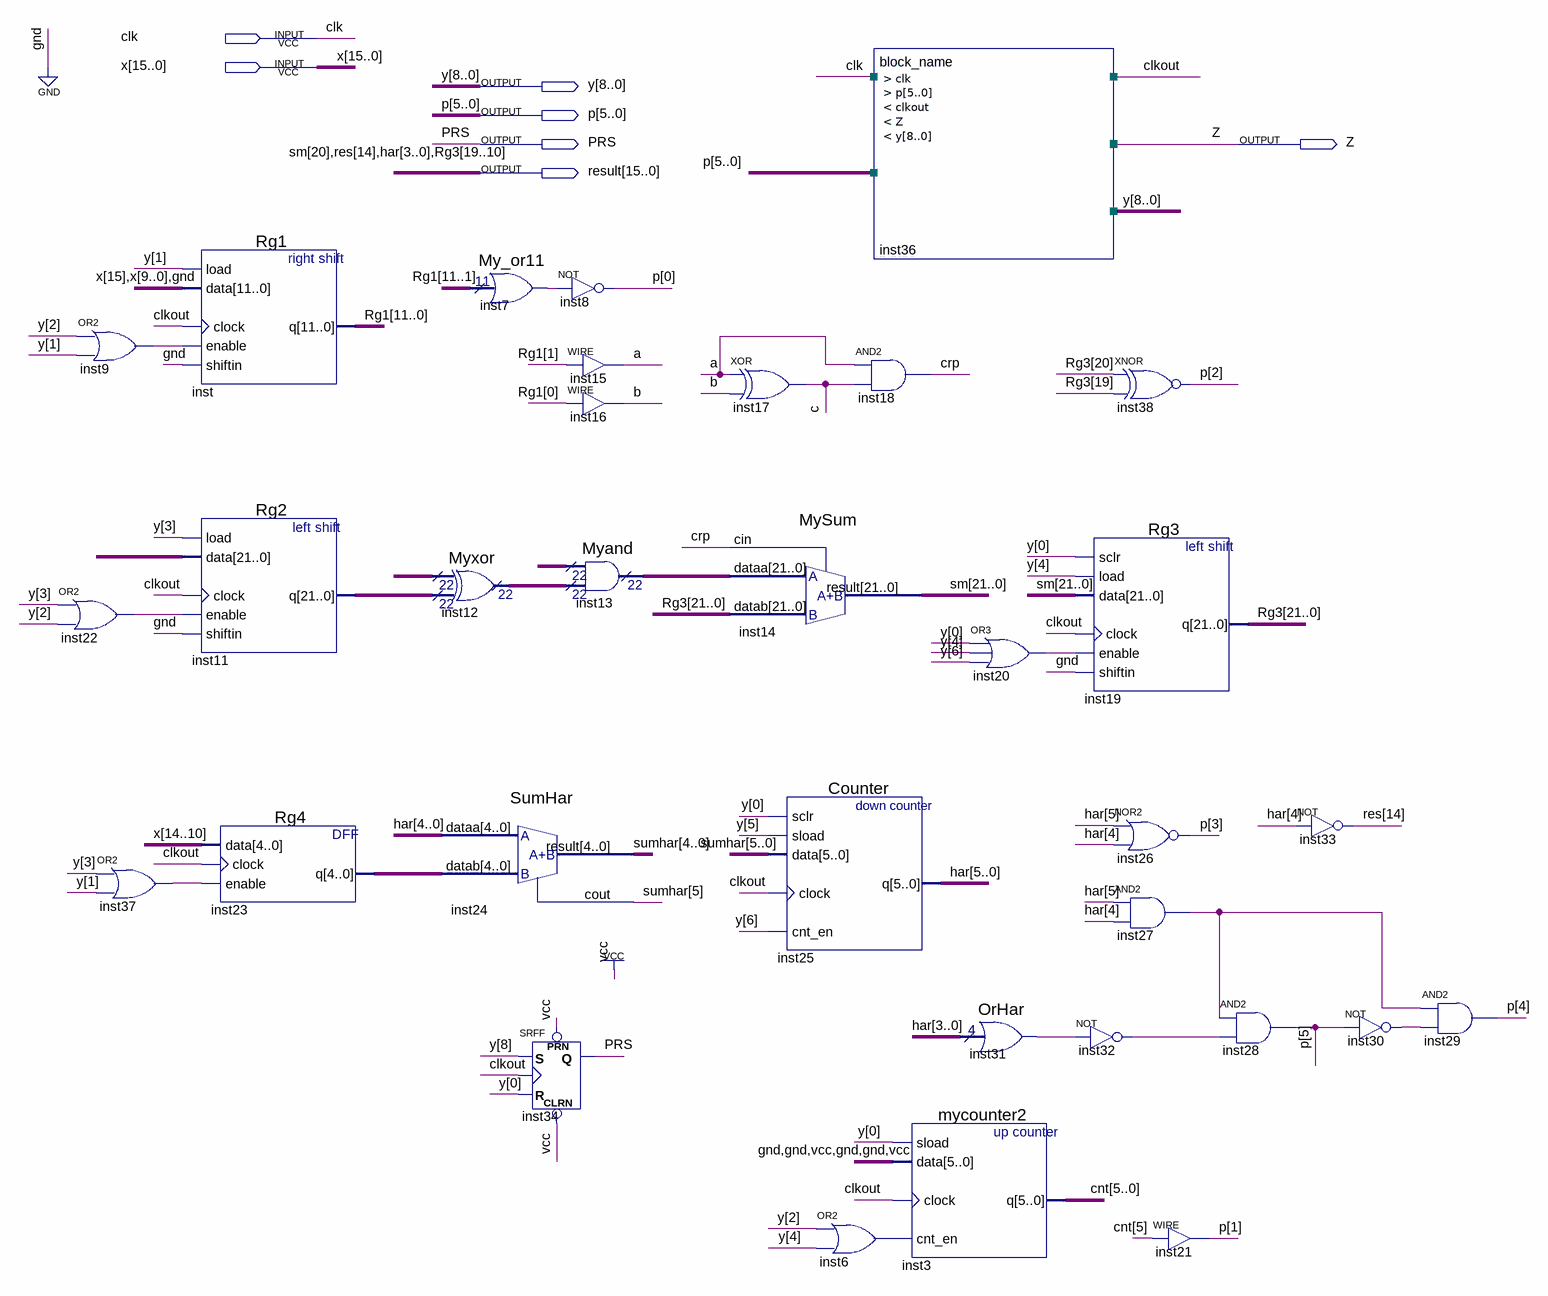
[diagram p0: schematic sheet]
// Quartus schematic OA.bdf as structural Verilog: 33 symbols, 7 pins
module OA (
  input  clk,
  input  [15:0] x,
  output [8:0] y,
  output [5:0] p,
  output PRS,
  output Z,
  output [15:0] result
);

  wire a, b, c, clkout, crp, inst6_out, inst7_result, inst9_out, inst20_out, inst22_out, inst27_out,
       inst30_out, inst31_result, inst32_out, inst37_out;
  wire [4:0] inst23_q;
  wire [5:0] cnt, sumhar;
  wire [5:4] har;
  wire [11:0] Rg1;
  wire [21:0] inst11_q, inst12_result, inst13_result, Rg3, sm;

  or inst22 (inst22_out, y[3], y[2]);
  or inst9 (inst9_out, y[2], y[1]);
  or inst37 (inst37_out, y[3], y[1]);
  Rg1 inst (.load(y[1]), .data({x[15], x[9:0], 1'b0}), .clock(clkout), .enable(inst9_out), .shiftin(1'b0), .q(Rg1));
  Rg2 inst11 (
    .load(y[3]), .data({{12{x[15]}}, x[9:0]}), .clock(clkout), .enable(inst22_out), .shiftin(1'b0),
    .q(inst11_q));
  Rg4 inst23 (.data(x[14:10]), .clock(clkout), .enable(inst37_out), .q(inst23_q));
  Myxor inst12 (.data0x({22{a}}), .data1x(inst11_q), .result(inst12_result));
  SumHar inst24 (.dataa({har[4], result[13:10]}), .datab(inst23_q), .result(sumhar[4:0]), .cout(sumhar[5]));
  My_or11 inst7 (.data(Rg1[11:1]), .result(inst7_result));
  SRFF inst34 (.PRN(1'b1), .CLRN(1'b1), .S(y[8]), .R(y[0]), .CLK(clkout), .Q(PRS));
  not inst8 (p[0], inst7_result);
  assign a = Rg1[1];  // WIRE inst15
  assign b = Rg1[0];  // WIRE inst16
  Myand inst13 (.data0x({22{c}}), .data1x(inst12_result), .result(inst13_result));
  xor inst17 (c, a, b);
  MySum inst14 (
    .dataa(inst13_result), .datab({Rg3[21:20], result[9:0], Rg3[9:0]}), .cin(crp),
    .result({sm[21], result[15], sm[19:0]}));
  Counter inst25 (.sclr(y[0]), .sload(y[5]), .data(sumhar), .clock(clkout), .cnt_en(y[6]), .q({har, result[13:10]}));
  or inst6 (inst6_out, y[2], y[4]);
  block_name inst36 (.clk(clk), .p(p), .clkout(clkout), .Z(Z), .y(y));
  and inst18 (crp, a, c);
  mycounter2 inst3 (.sload(y[0]), .data(6'b001001), .clock(clkout), .cnt_en(inst6_out), .q(cnt));
  or inst20 (inst20_out, y[0], y[4], y[6]);
  OrHar inst31 (.data(result[13:10]), .result(inst31_result));
  xnor inst38 (p[2], Rg3[20], result[9]);
  Rg3 inst19 (
    .sclr(y[0]), .load(y[4]), .data({sm[21], result[15], sm[19:0]}), .clock(clkout), .enable(inst20_out),
    .shiftin(1'b0), .q({Rg3[21:20], result[9:0], Rg3[9:0]}));
  nor inst26 (p[3], har[5], har[4]);
  and inst27 (inst27_out, har[5], har[4]);
  not inst32 (inst32_out, inst31_result);
  assign p[1] = cnt[5];  // WIRE inst21
  and inst28 (p[5], inst27_out, inst32_out);
  not inst33 (result[14], har[4]);
  not inst30 (inst30_out, p[5]);
  and inst29 (p[4], inst27_out, inst30_out);

  // Other names for the same wires on the sheet: har[3:0] = result[13:10]; res[14] = result[14];
  //   Rg3[19:10] = result[9:0]; sm[20] = result[15]
endmodule
